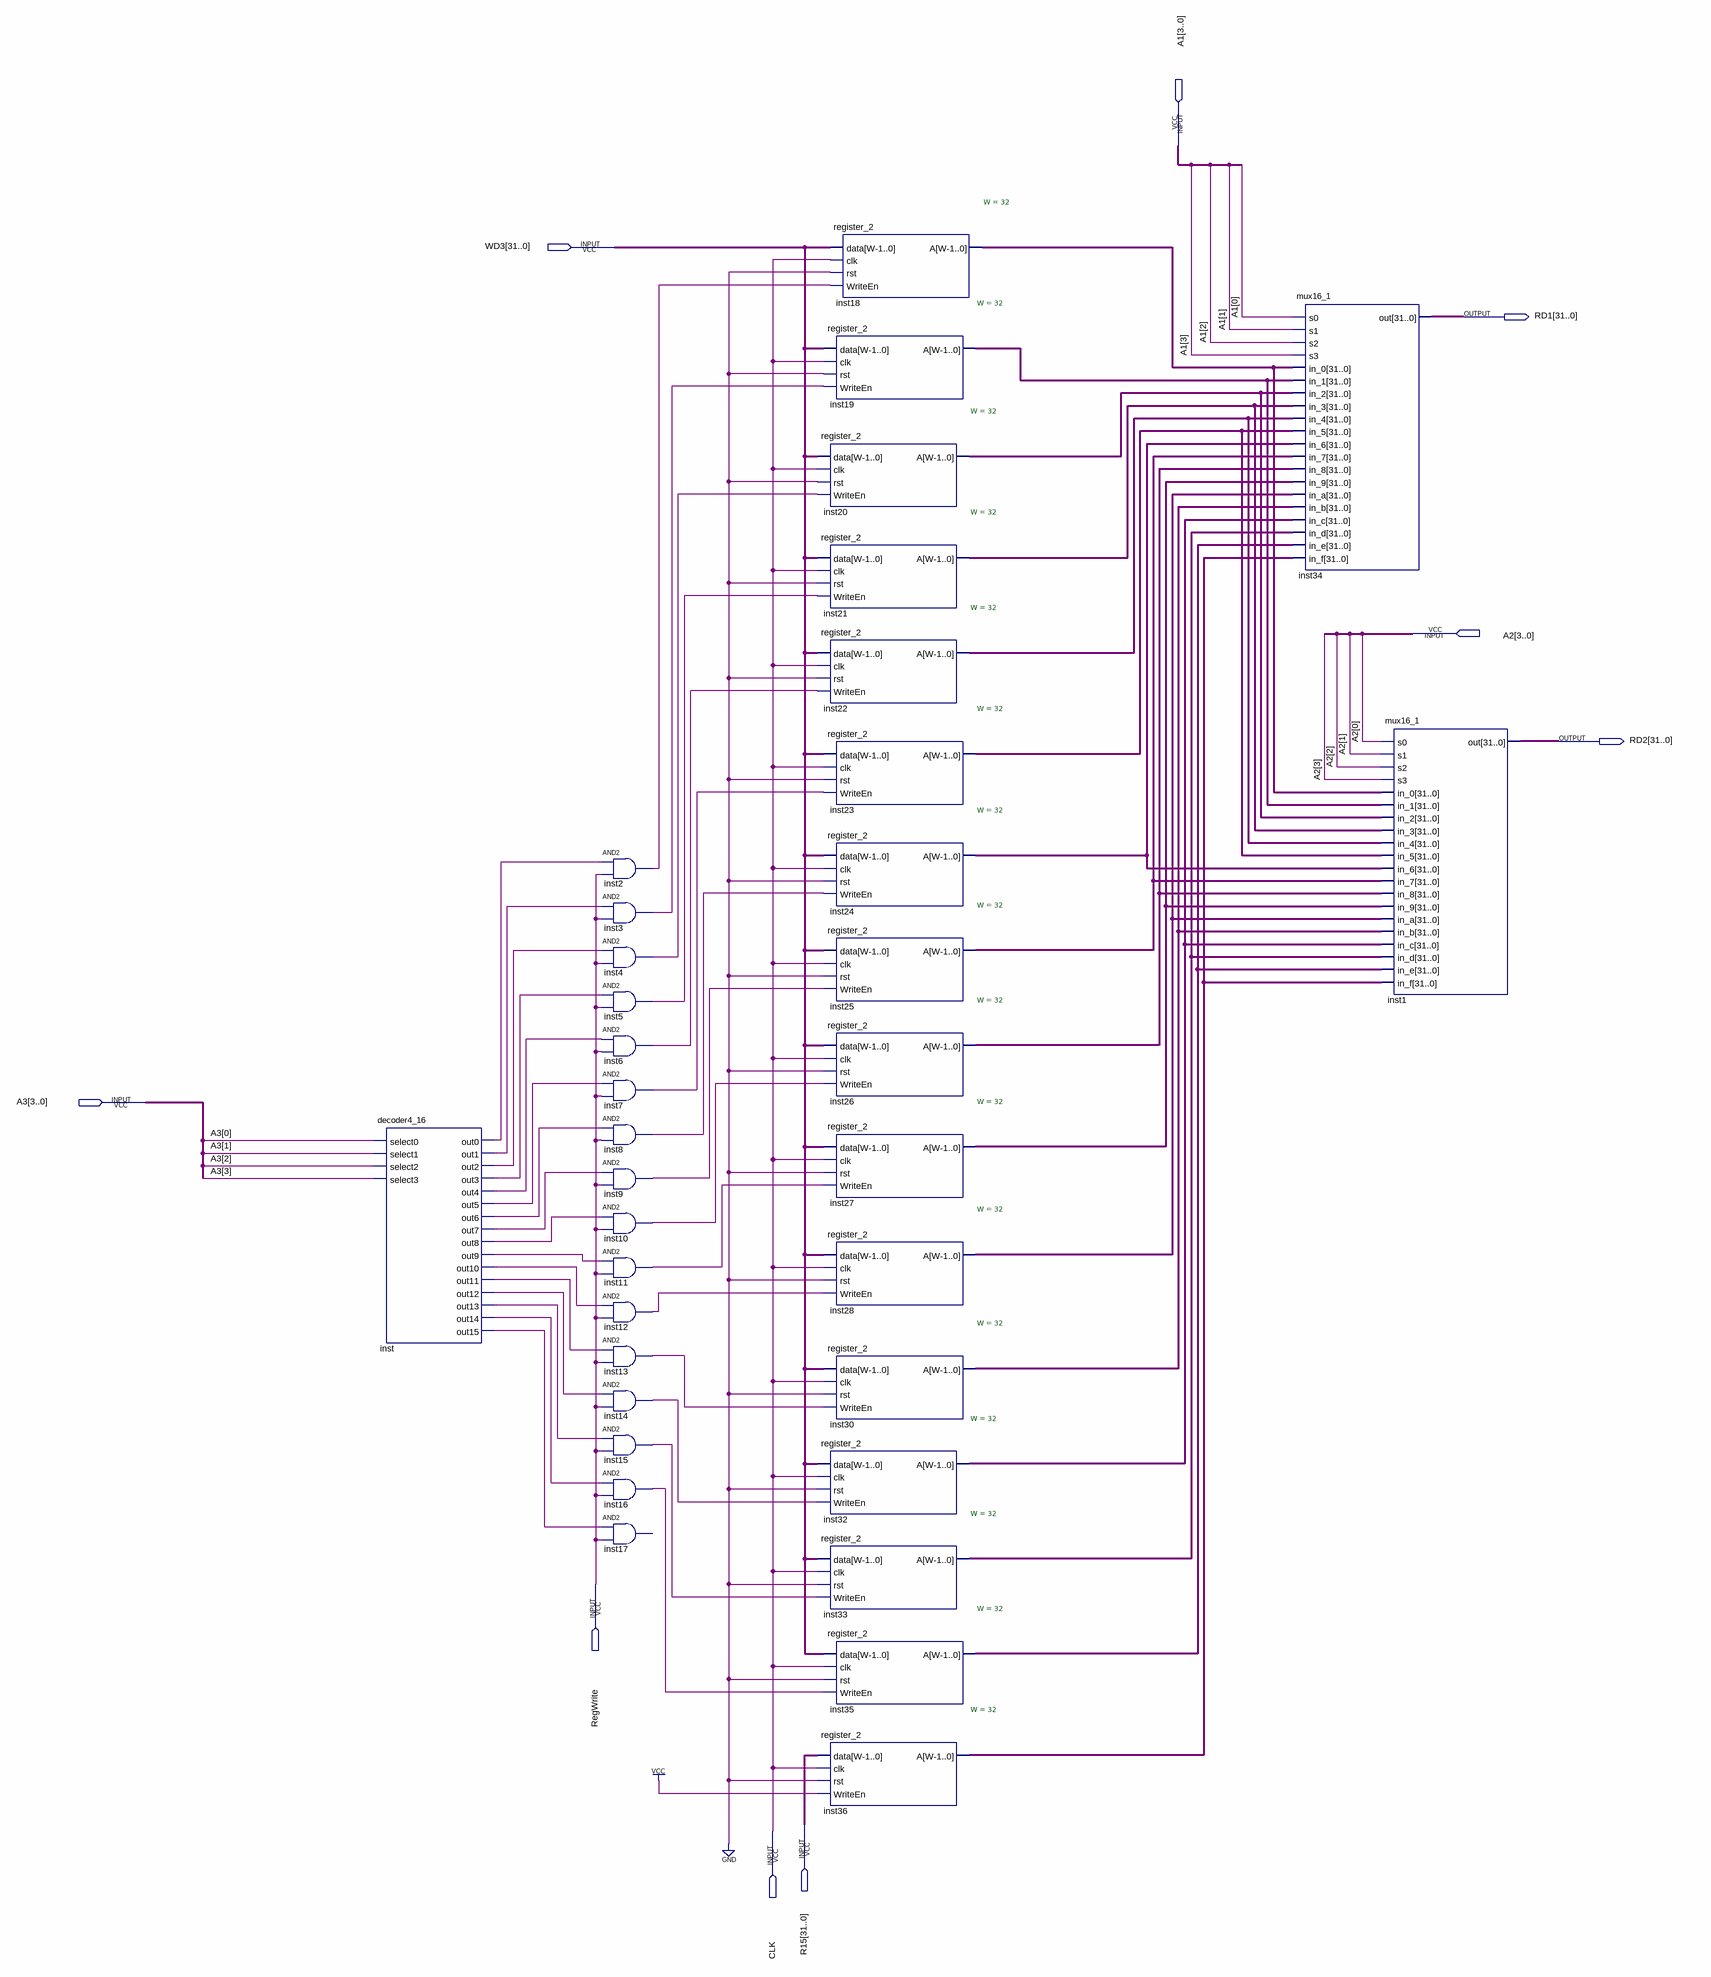
[diagram p0: schematic sheet]
// Quartus schematic Register_File.bdf as structural Verilog: 35 symbols, 9 pins
module Register_File (
  input  [3:0] A1,
  input  [31:0] WD3,
  input  [3:0] A2,
  input  [3:0] A3,
  input  RegWrite,
  input  [31:0] R15,
  input  CLK,
  output [31:0] RD1,
  output [31:0] RD2
);

  wire inst2_out, inst3_out, inst4_out, inst5_out, inst6_out, inst7_out, inst8_out, inst9_out, inst10_out,
       inst11_out, inst12_out, inst13_out, inst14_out, inst15_out, inst16_out, inst_out0, inst_out1,
       inst_out2, inst_out3, inst_out4, inst_out5, inst_out6, inst_out7, inst_out8, inst_out9, inst_out10,
       inst_out11, inst_out12, inst_out13, inst_out14, inst_out15;
  wire [31:0] inst18_a, inst19_a, inst20_a, inst21_a, inst22_a, inst23_a, inst24_a, inst25_a, inst26_a,
       inst27_a, inst28_a, inst30_a, inst32_a, inst33_a, inst35_a, inst36_a;

  decoder4_16 inst (
    .select0(A3[0]), .select1(A3[1]), .select2(A3[2]), .select3(A3[3]), .out0(inst_out0), .out1(inst_out1),
    .out2(inst_out2), .out3(inst_out3), .out4(inst_out4), .out5(inst_out5), .out6(inst_out6),
    .out7(inst_out7), .out8(inst_out8), .out9(inst_out9), .out10(inst_out10), .out11(inst_out11),
    .out12(inst_out12), .out13(inst_out13), .out14(inst_out14), .out15(inst_out15));
  and inst2 (inst2_out, inst_out0, RegWrite);
  and inst3 (inst3_out, inst_out1, RegWrite);
  and inst4 (inst4_out, inst_out2, RegWrite);
  and inst5 (inst5_out, inst_out3, RegWrite);
  and inst6 (inst6_out, inst_out4, RegWrite);
  and inst7 (inst7_out, inst_out5, RegWrite);
  and inst8 (inst8_out, inst_out6, RegWrite);
  and inst9 (inst9_out, inst_out7, RegWrite);
  and inst10 (inst10_out, inst_out8, RegWrite);
  and inst11 (inst11_out, inst_out9, RegWrite);
  and inst12 (inst12_out, inst_out10, RegWrite);
  and inst13 (inst13_out, inst_out11, RegWrite);
  and inst14 (inst14_out, inst_out12, RegWrite);
  and inst15 (inst15_out, inst_out13, RegWrite);
  and inst16 (inst16_out, inst_out14, RegWrite);
  // AND2 inst17 has open pins: IN1=inst_out15, IN2=RegWrite, OUT=open
  register_2 #(.W(32)) inst20 (.data(WD3), .clk(CLK), .rst(1'b0), .WriteEn(inst4_out), .A(inst20_a));
  register_2 #(.W(32)) inst21 (.data(WD3), .clk(CLK), .rst(1'b0), .WriteEn(inst5_out), .A(inst21_a));
  register_2 #(.W(32)) inst22 (.data(WD3), .clk(CLK), .rst(1'b0), .WriteEn(inst6_out), .A(inst22_a));
  register_2 #(.W(32)) inst32 (.data(WD3), .clk(CLK), .rst(1'b0), .WriteEn(inst14_out), .A(inst32_a));
  register_2 #(.W(32)) inst33 (.data(WD3), .clk(CLK), .rst(1'b0), .WriteEn(inst15_out), .A(inst33_a));
  register_2 #(.W(32)) inst36 (.data(R15), .clk(CLK), .rst(1'b0), .WriteEn(1'b1), .A(inst36_a));
  register_2 #(.W(32)) inst18 (.data(WD3), .clk(CLK), .rst(1'b0), .WriteEn(inst2_out), .A(inst18_a));
  register_2 #(.W(32)) inst19 (.data(WD3), .clk(CLK), .rst(1'b0), .WriteEn(inst3_out), .A(inst19_a));
  register_2 #(.W(32)) inst23 (.data(WD3), .clk(CLK), .rst(1'b0), .WriteEn(inst7_out), .A(inst23_a));
  register_2 #(.W(32)) inst24 (.data(WD3), .clk(CLK), .rst(1'b0), .WriteEn(inst8_out), .A(inst24_a));
  register_2 #(.W(32)) inst25 (.data(WD3), .clk(CLK), .rst(1'b0), .WriteEn(inst9_out), .A(inst25_a));
  register_2 #(.W(32)) inst26 (.data(WD3), .clk(CLK), .rst(1'b0), .WriteEn(inst10_out), .A(inst26_a));
  register_2 #(.W(32)) inst27 (.data(WD3), .clk(CLK), .rst(1'b0), .WriteEn(inst11_out), .A(inst27_a));
  register_2 #(.W(32)) inst28 (.data(WD3), .clk(CLK), .rst(1'b0), .WriteEn(inst12_out), .A(inst28_a));
  register_2 #(.W(32)) inst30 (.data(WD3), .clk(CLK), .rst(1'b0), .WriteEn(inst13_out), .A(inst30_a));
  register_2 #(.W(32)) inst35 (.data(WD3), .clk(CLK), .rst(1'b0), .WriteEn(inst16_out), .A(inst35_a));
  mux16_1 inst34 (
    .s0(A1[0]), .s1(A1[1]), .s2(A1[2]), .s3(A1[3]), .in_0(inst18_a), .in_1(inst19_a), .in_2(inst20_a),
    .in_3(inst21_a), .in_4(inst22_a), .in_5(inst23_a), .in_6(inst24_a), .in_7(inst25_a), .in_8(inst26_a),
    .in_9(inst27_a), .in_a(inst28_a), .in_b(inst30_a), .in_c(inst32_a), .in_d(inst33_a), .in_e(inst35_a),
    .in_f(inst36_a), .out(RD1));
  mux16_1 inst1 (
    .s0(A2[0]), .s1(A2[1]), .s2(A2[2]), .s3(A2[3]), .in_0(inst18_a), .in_1(inst19_a), .in_2(inst20_a),
    .in_3(inst21_a), .in_4(inst22_a), .in_5(inst23_a), .in_6(inst24_a), .in_7(inst25_a), .in_8(inst26_a),
    .in_9(inst27_a), .in_a(inst28_a), .in_b(inst30_a), .in_c(inst32_a), .in_d(inst33_a), .in_e(inst35_a),
    .in_f(inst36_a), .out(RD2));
endmodule
